# EAGLE design BinaryClock-v5 (EAGLE 7.2.0)
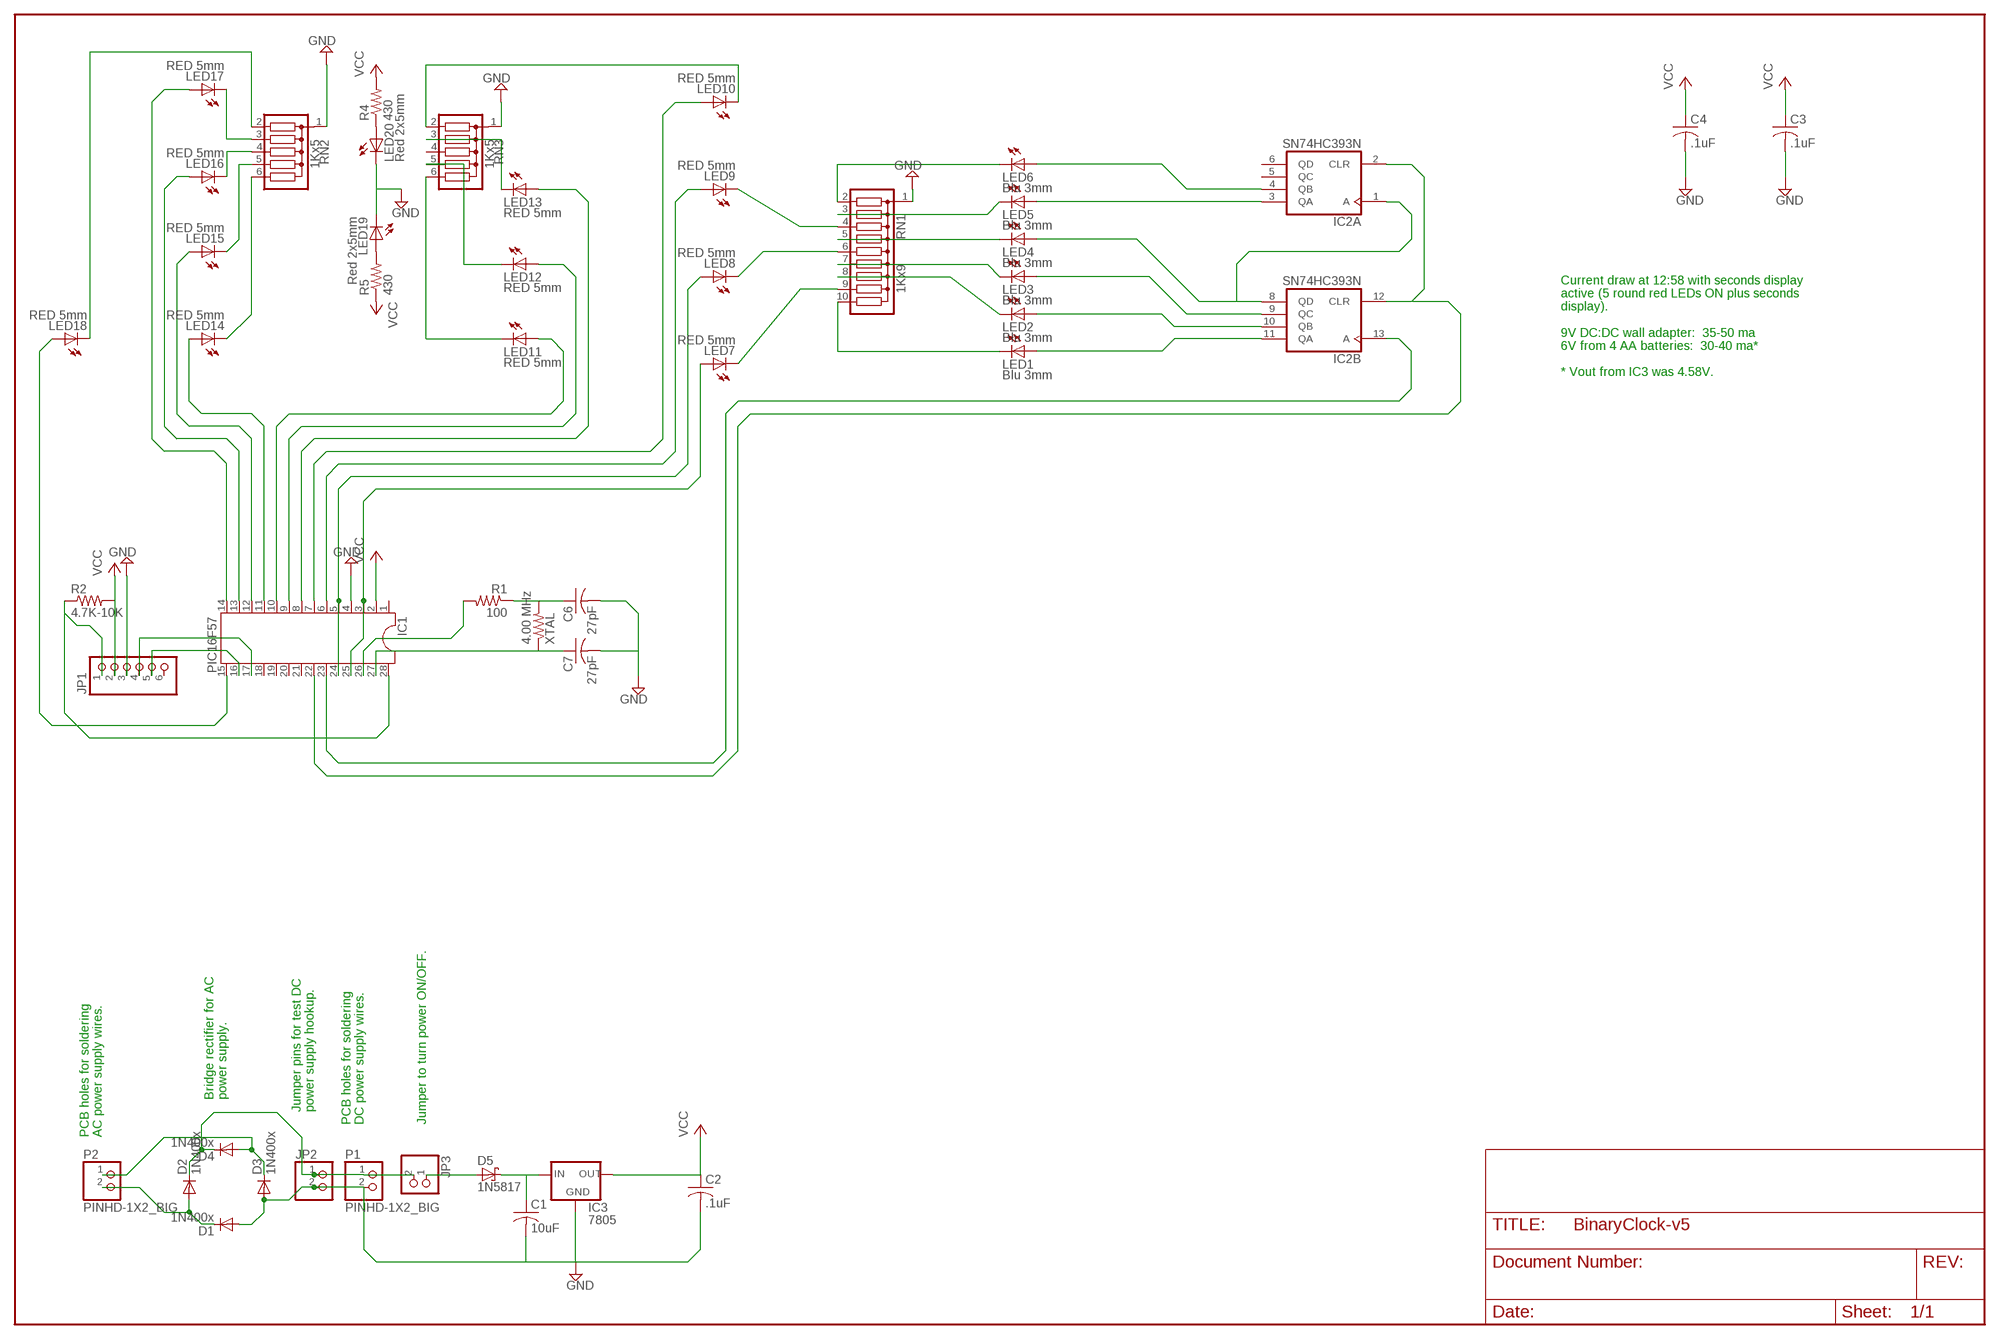
[diagram p0: schematic, sheet 1]

## Parts
C1  10uF  C-US025-050X050  [C025-050X050]
C2  .1uF  C-US050-025X075  [C050-025X075]
C3  .1uF  C-US050-025X075  [C050-025X075]
C4  .1uF  C-US050-025X075  [C050-025X075]
C6  27pF  C-US025-025X050  [C025-025X050]
C7  27pF  C-US025-025X050  [C025-025X050]
D1  1N400x  DIODE-D-7.5  [D-7.5]
D2  1N400x  DIODE-D-7.5  [D-7.5]
D3  1N400x  DIODE-D-7.5  [D-7.5]
D4  1N400x  DIODE-D-7.5  [D-7.5]
D5  1N5817  [0207/2V]
IC1  PIC16F57  DIL28-3  [DIL28-3]
IC2  SN74HC393N  74HC393N  [DIL14]
IC3  7805  78MXXS  [78MXXS]
JP1  PINHD-1X6/90  [1X06/90]
JP2  PINHD-1X2  [1X02]
JP3  PINHD-1X2  [1X02]
LED1  Blu 3mm  LED3MM  [LED3MM]
LED2  Blu 3mm  LED3MM  [LED3MM]
LED3  Blu 3mm  LED3MM  [LED3MM]
LED4  Blu 3mm  LED3MM  [LED3MM]
LED5  Blu 3mm  LED3MM  [LED3MM]
LED6  Blu 3mm  LED3MM  [LED3MM]
LED7  RED 5mm  LED5MM  [LED5MM]
LED8  RED 5mm  LED5MM  [LED5MM]
LED9  RED 5mm  LED5MM  [LED5MM]
LED10  RED 5mm  LED5MM  [LED5MM]
LED11  RED 5mm  LED5MM  [LED5MM]
LED12  RED 5mm  LED5MM  [LED5MM]
LED13  RED 5mm  LED5MM  [LED5MM]
LED14  RED 5mm  LED5MM  [LED5MM]
LED15  RED 5mm  LED5MM  [LED5MM]
LED16  RED 5mm  LED5MM  [LED5MM]
LED17  RED 5mm  LED5MM  [LED5MM]
LED18  RED 5mm  LED5MM  [LED5MM]
LED19  Red 2x5mm  U57X32  [U57X32]
LED20  Red 2x5mm  U57X32  [U57X32]
P1  PINHD-1X2_BIG  [1X02_BIG]
P2  PINHD-1X2_BIG  [1X02_BIG]
R1  100  R-US_0207/7  [0207/7]
R2  4.7K-10K  R-US_0207/2V  [0207/2V]
R4  430  R-US_0204/5  [0204/5]
R5  430  R-US_0204/7  [0204/7]
RN1  1Kx9  G09R  [SIL10]
RN2  1Kx5  G05R  [SIL6]
RN3  1Kx5  G05R  [SIL6]
XTAL  4.00 MHz  R-US_0204/5  [0204/5]

## Nets
GND: C1.2 C2.2 C3.2 C4.2 C6.2 C7.2 D1.A D3.A IC1.4 IC3.GND JP1.3 JP2.2 LED19.K(C) LED20.K(C) P1.2 RN1.1 RN2.1 RN3.1
N$1: IC2.3(A:QA) LED5.A
N$2: IC2.11(B:QA) LED1.A
N$3: IC2.10(B:QB) LED2.A
N$4: IC2.9(B:QC) LED3.A
N$5: IC2.1(A:A) IC2.8(B:QD) LED4.A
N$6: C1.1 D5.2(C) IC3.IN
N$7: IC2.4(A:QB) LED6.A
N$8: IC1.22 IC2.2(A:CLR) IC2.12(B:CLR)
N$9: C7.1 IC1.27 XTAL.1
N$10: C6.1 R1.1 XTAL.2
N$11: LED1.K(C) RN1.10
N$12: IC1.26 R1.2
N$13: LED7.K(C) RN1.9
N$14: IC1.28 JP1.1 R2.1
N$15: IC1.8 LED13.A
N$16: IC1.16 JP1.5
N$17: IC1.23 IC2.13(B:A)
N$18: IC1.3 IC1.25 LED7.A
N$19: IC1.5 IC1.24 LED8.A
N$20: IC1.6 LED9.A
N$21: IC1.7 LED10.A
N$22: IC1.9 LED12.A
N$23: IC1.10 LED11.A
N$24: IC1.11 LED14.A
N$25: IC1.12 LED15.A
N$26: IC1.13 LED16.A
N$27: IC1.14 LED17.A
N$28: IC1.17 JP1.4
N$29: LED2.K(C) RN1.8
N$30: LED4.K(C) RN1.5
N$31: IC1.15 LED18.A
N$32: LED9.K(C) RN1.4
N$33: LED3.K(C) RN1.7
N$34: LED8.K(C) RN1.6
N$35: LED5.K(C) RN1.3
N$36: LED6.K(C) RN1.2
N$37: LED10.K(C) RN3.2
N$38: LED13.K(C) RN3.3
N$39: LED11.K(C) RN3.6
N$40: LED12.K(C) RN3.5
N$41: LED14.K(C) RN2.6
N$42: LED15.K(C) RN2.5
N$43: LED16.K(C) RN2.4
N$44: LED17.K(C) RN2.3
N$45: LED18.K(C) RN2.2
N$46: D2.C D4.C JP2.1 JP3.2 P1.1
N$47: LED20.A R4.1
N$48: LED19.A R5.2
N$50: D1.C D2.A P2.2
N$51: D3.C D4.A P2.1
N$168: D5.1(A) JP3.1
VCC: C2.1 C3.1 C4.1 IC1.2 IC3.OUT JP1.2 R2.2 R4.2 R5.1
Unconnected: IC1.1 IC1.18 IC1.19 IC1.20 IC1.21 IC2.5(A:QC) IC2.6(A:QD) JP1.6 RN3.4

## Notes on the sheet
- Current draw at 12:58 with seconds display
  active (5 round red LEDs ON plus seconds
  display).
  
  9V DC:DC wall adapter:  35-50 ma
  6V from 4 AA batteries:  30-40 ma*
  
  * Vout from IC3 was 4.58V.
- Bridge rectifier for AC 
  power supply.
- Jumper pins for test DC
  power supply hookup.
- PCB holes for soldering
  DC power supply wires.
- Jumper to turn power ON/OFF.
- PCB holes for soldering
  AC power supply wires.

## Power pins joined to a net without a drawn wire
GND: IC2.7(P:GND)
VCC: IC2.14(P:VCC)

## Library data of the parts
C1-C4 C6 C7 = rcl:C-US: CAPACITOR, American symbol
D1-D4 = diode:DIODE-: DIODE
D5 = DScott:1N5817
IC1 = ic-package:DIL28: Dual In Line
IC2 = 74xx-eu:74*393: Dual 4-bit decade and binary COUNTER
IC3 = v-reg:78MXXS: VOLTAGE REGULATOR
JP1 = pinhead:PINHD-1X6: PIN HEADER
JP2 JP3 = pinhead:PINHD-1X2: PIN HEADER
LED1-LED18 = led:LED: LED OSRAM: - CHIPLED LG R971, LG N971, LY N971, LG Q971, LY Q971, LO R971, LY R971 LH N974, LH R974 LS Q976, LO Q976, LY Q976 LO Q996 - Hyper CHIPLED LW Q18S LB Q993, LB Q99A, LB R99A - SideLED LS A670, LO A670, LY A670, LG A670, LP A670 LB A673, LV A673, LT A673, LW A673 LH A674 LY A675 LS A676, LA A676, LO A676, LY A676, LW A676 LS A679, LY A679, LG A679 - Hyper Micro SIDELED® LS Y876, LA Y876, LO Y876, LY Y876 LT Y87S - SmartLED LW L88C, LW L88S LB L89C, LB L89S, LG L890 LS L89K, LO L89K, LY L89K LS L896, LA L896, LO L896, LY L896 - TOPLED LS T670, LO T670, LY T670, LG T670, LP T670 LSG T670, LSP T670, LSY T670, LOP T670, LYG T670 LG T671, LOG T671, LSG T671 LB T673, LV T673, LT T673, LW T673 LH T674 LS T676, LA T676, LO T676, LY T676, LB T676, LH T676, LSB T676, LW T676 LB T67C, LV T67C, LT T67C, LS T67K, LO T67K, LY T67K, LW E67C LS E67B, LA E67B, LO E67B, LY E67B, LB E67C, LV E67C, LT E67C LW T67C LS T679, LY T679, LG T679 LS T770, LO T770, LY T770, LG T770, LP T770 LB T773, LV T773, LT T773, LW T773 LH T774 LS E675, LA E675, LY E675, LS T675 LS T776, LA T776, LO T776, LY T776, LB T776 LHGB T686 LT T68C, LB T68C - Hyper Mini TOPLED® LB M676 - Mini TOPLED Santana® LG M470 LS M47K, LO M47K, LY M47K Source: http://www.osram.convergy.de LUXEON: - LUMILED® LXK2-PW12-R00, LXK2-PW12-S00, LXK2-PW14-U00, LXK2-PW14-V00 LXK2-PM12-R00, LXK2-PM12-S00, LXK2-PM14-U00 LXK2-PE12-Q00, LXK2-PE12-R00, LXK2-PE12-S00, LXK2-PE14-T00, LXK2-PE14-U00 LXK2-PB12-K00, LXK2-PB12-L00, LXK2-PB12-M00, LXK2-PB14-N00, LXK2-PB14-P00, LXK2-PB14-Q00 LXK2-PR12-L00, LXK2-PR12-M00, LXK2-PR14-Q00, LXK2-PR14-R00 LXK2-PD12-Q00, LXK2-PD12-R00, LXK2-PD12-S00 LXK2-PH12-R00, LXK2-PH12-S00 LXK2-PL12-P00, LXK2-PL12-Q00, LXK2-PL12-R00 Source: www.luxeon.com KINGBRIGHT: KA-3528ASYC Source: www.kingbright.com
LED19 LED20 = led:U57X32: LED rectangle, 5.7 x 3.2 mm
P1 P2 = DScott:PINHD-1X2_BIG
R1 R2 R4 R5 XTAL = rcl:R-US_: RESISTOR, American symbol
RN1 = resistor-sil:G09R: SIL RESISTOR; OC_FARNELL: unknown; OC_NEWARK: unknown
RN2 RN3 = resistor-sil:G05R: SIL RESISTOR; OC_FARNELL: unknown; OC_NEWARK: unknown

## Net classes
0 default: width 0.305 mm, clearance 0.305 mm

## Board
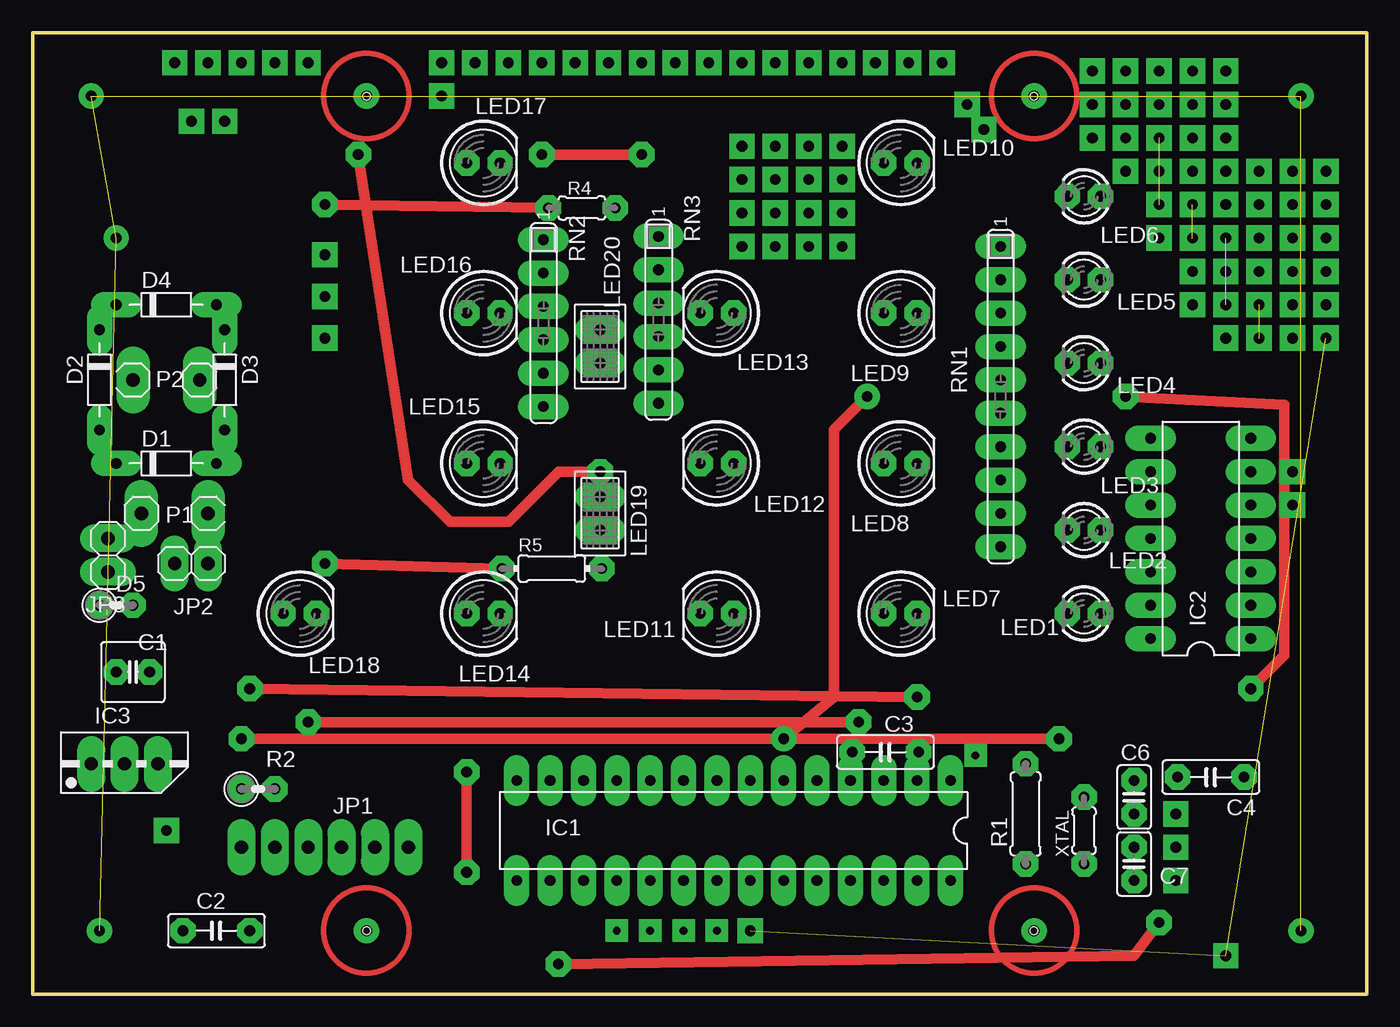
[diagram p1: board, top side]
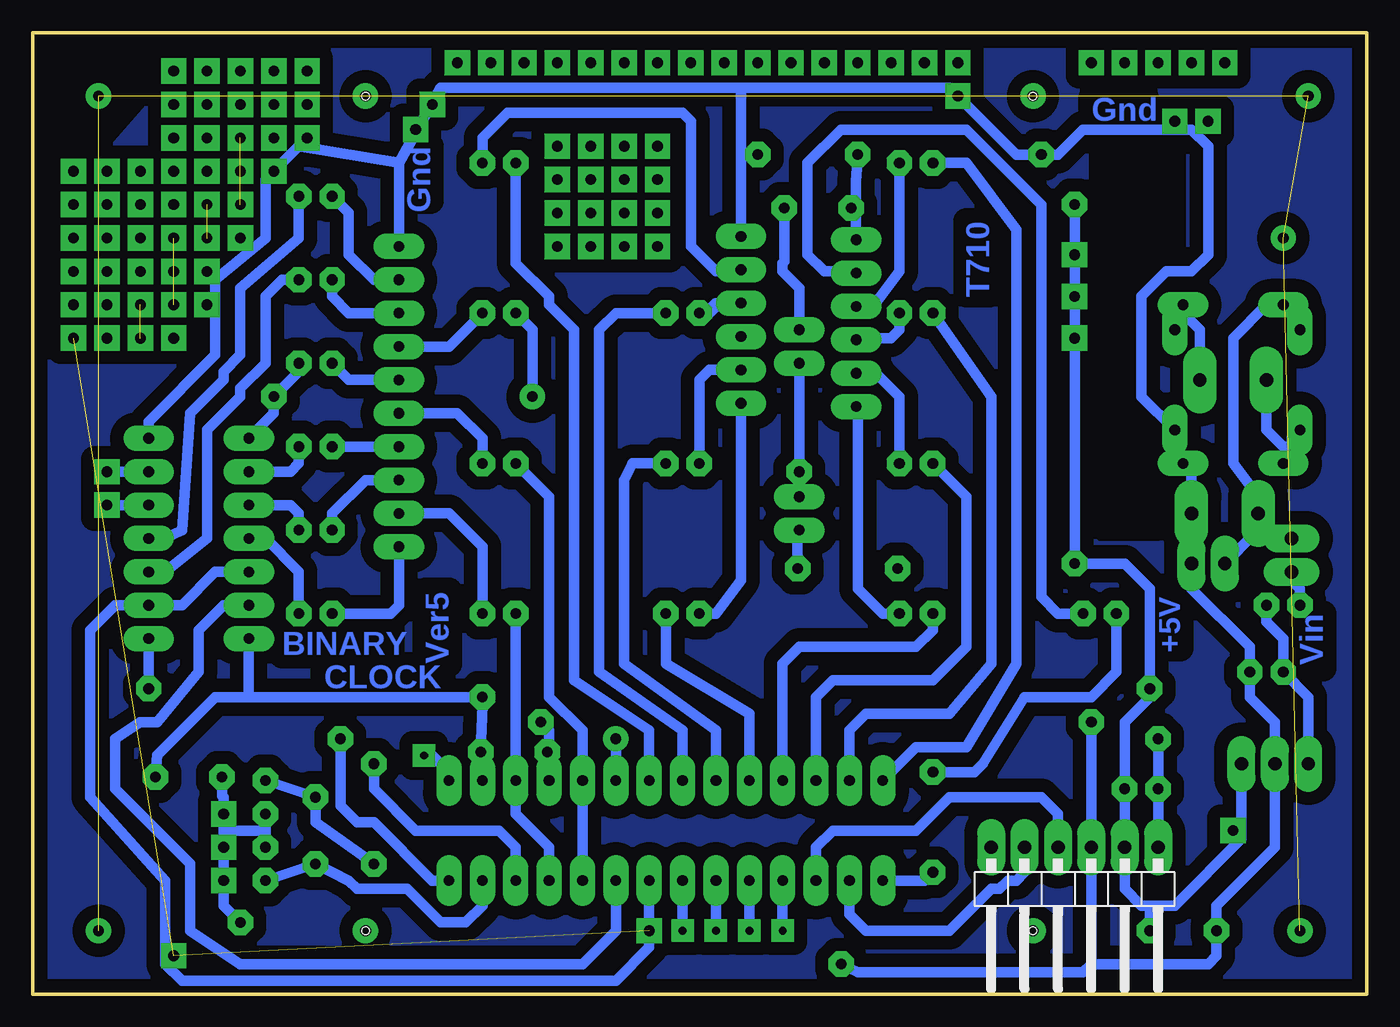
[diagram p2: board, bottom side, seen from below]

Size 101.52 x 73.14 mm. Coordinates in mm from the lower left corner, seen from the top.
Outline: 0,0 101.52,0 101.52,73.14 0,73.14 0,0
Copper layers (1*16): Top 0.035mm / dielectric 1.5mm / Bottom 0.035mm
Design rules "default *": minimum track width 32mil, minimum drill 32mil, track to track 8mil, track to pad 8mil, pad to pad 8mil, via to via 8mil, smd to smd 8mil, copper to edge 8mil, drill to drill 8mil, minimum pad ring 22mil, minimum via ring 22mil, stop-mask expansion 4mil, vias tented up to drill 0mil, thermal gap 10mil
Holes 0.6 mm at 25.4,68.33 76.2,68.33 76.2,4.83 25.4,4.83

### Footprints (pad centres in the part's own frame; a part is rotated, then mirrored left to right if it is on the bottom)
C025-050X050 = drill 0.813 octagon: 1 -1.27,0; 2 1.27,0
C050-025X075 = drill 0.813 octagon: 1 -2.54,0; 2 2.54,0
C025-025X050 = drill 0.813 octagon: 1 -1.27,0; 2 1.27,0
D-7.5 = drill 0.813 long: A 3.81,0; C -3.81,0
0207/2V = drill 0.813 octagon: 1 -1.27,0; 2 1.27,0
DIL28-3 = drill 0.813 long: 1 -16.51,-3.81; 2 -13.97,-3.81; 3 -11.43,-3.81; 4 -8.89,-3.81; 5 -6.35,-3.81; 6 -3.81,-3.81; 7 -1.27,-3.81; 8 1.27,-3.81; 9 3.81,-3.81; 10 6.35,-3.81; 11 8.89,-3.81; 12 11.43,-3.81; 13 13.97,-3.81; 14 16.51,-3.81; 15 16.51,3.81; 16 13.97,3.81; 17 11.43,3.81; 18 8.89,3.81; 19 6.35,3.81; 20 3.81,3.81; 21 1.27,3.81; 22 -1.27,3.81; 23 -3.81,3.81; 24 -6.35,3.81; 25 -8.89,3.81; 26 -11.43,3.81; 27 -13.97,3.81; 28 -16.51,3.81
DIL14 = drill 0.813 long: 1 -7.62,-3.81; 2 -5.08,-3.81; 3 -2.54,-3.81; 4 0,-3.81; 5 2.54,-3.81; 6 5.08,-3.81; 7 7.62,-3.81; 8 7.62,3.81; 9 5.08,3.81; 10 2.54,3.81; 11 0,3.81; 12 -2.54,3.81; 13 -5.08,3.81; 14 -7.62,3.81
78MXXS = drill 1.016 long: GND 0,-2.54; IN -2.54,-2.54; OUT 2.54,-2.54
1X06/90 = drill 1.016 long: 1 -6.35,-3.81; 2 -3.81,-3.81; 3 -1.27,-3.81; 4 1.27,-3.81; 5 3.81,-3.81; 6 6.35,-3.81
1X02 = drill 1.016 long: 1 -1.27,0; 2 1.27,0
LED3MM = drill 0.813 octagon: A -1.27,0; K 1.27,0
LED5MM = drill 0.813 octagon: A -1.27,0; K 1.27,0
U57X32 = drill 0.813 long: A -1.27,0; K 1.27,0
1X02_BIG = drill 1.016 pad 2.54 long: 1 -1.27,0; 2 3.81,0
0207/7 = drill 0.813 octagon: 1 -3.81,0; 2 3.81,0
0204/5 = drill 0.813 octagon: 1 -2.54,0; 2 2.54,0
0204/7 = drill 0.813 octagon: 1 -3.81,0; 2 3.81,0
SIL10 = drill 0.813 long: 1 -11.43,0; 2 -8.89,0; 3 -6.35,0; 4 -3.81,0; 5 -1.27,0; 6 1.27,0; 7 3.81,0; 8 6.35,0; 9 8.89,0; 10 11.43,0
SIL6 = drill 0.813 long: 1 -6.35,0; 2 -3.81,0; 3 -1.27,0; 4 1.27,0; 5 3.81,0; 6 6.35,0

### Placement (x,y rotation side)
C1  7.62,24.51 0 top
C2  13.97,4.83 180 top
C3  64.9,18.41 180 top
C4  89.66,16.51 180 top
C6  83.82,14.99 270 top
C7  83.82,9.91 90 top
D1  10.16,40.39 0 top
D2  5.08,46.74 270 top
D3  14.61,46.74 270 top
D4  10.16,52.45 0 top
D5  6.35,29.59 0 top
IC1  53.34,12.45 180 top
IC2  88.9,34.67 90 top
IC3  6.99,20.07 0 top
JP1  22.23,7.37 180 bottom
JP2  12.06,32.77 0 top
JP3  5.71,33.4 90 top
LED1  80.01,28.96 180 top
LED2  80.01,35.31 180 top
LED3  80.01,41.66 180 top
LED4  80.01,48.01 180 top
LED5  80.01,54.36 180 top
LED6  80.01,60.71 180 top
LED7  66.04,28.96 0 top
LED8  66.04,40.39 0 top
LED9  66.04,51.82 0 top
LED10  66.04,63.25 0 top
LED11  52.07,28.96 180 top
LED12  52.07,40.39 180 top
LED13  52.07,51.82 180 top
LED14  34.29,28.96 0 top
LED15  34.29,40.39 0 top
LED16  34.29,51.82 0 top
LED17  34.29,63.25 0 top
LED18  20.32,28.96 0 top
LED19  43.18,36.58 90 top
LED20  43.18,49.28 270 top
P1  9.53,36.58 0 top
P2  11.43,46.74 180 top
R1  75.56,13.72 90 top
R2  17.14,15.62 0 top
R4  41.78,59.82 180 top
R5  39.5,32.39 0 top
RN1  73.66,45.47 270 top
RN2  38.86,51.05 270 top
RN3  47.62,51.31 270 top
XTAL  80.01,12.45 90 top

### Tracks (layer width: path | path; a pad name or v marks a point on that pad's centre or on a via)
GND  (via drill 0.81)
  Top 0.813: v46.35,63.88 v38.73,63.88 | v62.87,20.7 v20.95,20.7 | v85.72,5.46 83.82,2.92 v40.01,2.29 | v43.18,39.75 40.01,39.75 36.2,35.94 31.75,35.94 28.57,39.12 v24.77,63.88
  Bottom 0.813: 47.62,68.96 47.62,63.88 | 73.66,63.25 70.48,68.96 47.62,68.96 | RN3.1 47.62,63.88 | 47.62,63.88 v46.35,63.88 | v38.73,63.88 38.86,61.85 RN2.1 | RN1.1 73.66,63.25 | 73.66,63.25 81.28,64.52 83.82,61.98 83.82,57.53 87.63,54.36 87.63,48.64 92.71,43.56 IC2.7 | C4.2 87.12,15.11 87,14.99 87,12.45 | IC1.4 62.36,16.38 62.36,18.16 | 62.36,18.16 C3.2 | LED19.K v43.18,39.75 LED20.K | 62.36,18.16 62.23,18.16 62.23,20.07 v62.87,20.7 | 83.82,12.45 87,12.45 | 87,12.45 87,6.73 v85.72,5.46 | C7.2 83.82,12.45 | 83.82,12.45 C6.2 | v20.95,20.7 JP1.3 20.95,2.29 | 47.62,68.96 31.75,68.96 26.67,63.88 v24.77,63.88 23.5,63.88 21.59,65.79 13.34,65.79 12.06,64.52 12.06,56.26 13.34,54.99 15.24,54.99 17.14,53.09 17.14,45.47 D3.A 14.61,41.02 D1.A | 20.95,2.29 21.59,1.65 38.73,1.65 v40.01,2.29 | D1.A | 13.97,41.02 D1.A | D1.A 13.34,40.39 P1.2 JP2.2 13.34,30.86 8.89,26.42 C1.2 8.89,22.61 6.99,20.7 IC3.GND 6.99,11.18 11.43,6.73 C2.2 11.43,2.92 12.06,2.29 20.95,2.29
N$1
  Bottom 0.813: IC2.3 91.44,32.13 88.27,34.67 88.27,42.93 85.72,45.47 85.72,46.1 83.82,48.01 83.82,53.09 82.55,54.36 LED5.A
N$2
  Bottom 0.813: IC2.11 83.82,34.67 81.28,32.13 LED1.A
N$3
  Bottom 0.813: IC2.10 81.92,37.21 81.28,36.58 LED2.A
N$4
  Bottom 0.813: IC2.9 81.92,39.75 81.28,40.39 LED3.A
N$5  (via drill 0.81)
  Top 0.813: v92.71,23.24 95.25,25.78 95.25,44.83 v83.19,45.47
  Bottom 0.813: IC2.8 83.19,44.2 v83.19,45.47 81.28,47.37 LED4.A | IC2.1 v92.71,23.24
N$6
  Bottom 0.813: IC3.IN 4.45,22.61 C1.1 6.35,27.05 7.62,28.32 D5.2
N$7
  Bottom 0.813: IC2.4 91.44,34.67 90.17,35.31 89.53,44.2 87,46.74 87,47.37 85.72,48.64 85.72,53.72 81.28,57.53 LED6.A
N$8
  Bottom 0.813: IC2.12 87.63,32.13 90.17,29.59 IC2.2 95.25,29.59 97.16,27.69 97.16,14.99 91.44,8.64 91.44,2.29 90.17,1.02 57.15,1.02 54.61,3.56 IC1.22
N$9
  Bottom 0.813: C7.1 XTAL.1 77.47,8.64 76.83,8 73.03,8 70.48,5.46 68.58,5.46 67.31,6.73 IC1.27
N$10
  Bottom 0.813: C6.1 XTAL.2 80.01,13.08 R1.1
N$11
  Bottom 0.813: RN1.10 73.66,29.59 74.3,28.96 LED1.K
N$12
  Bottom 0.813: IC1.26 64.77,11.18 66.04,12.45 72.39,12.45 75.56,15.62 R1.2
N$13
  Bottom 0.813: RN1.9 69.85,36.58 67.31,34.04 LED7.K
N$14  (via drill 0.81)
  Top 0.813: v78.11,19.43 v15.88,19.43
  Bottom 0.813: JP1.1 R2.1 v15.88,19.43 | IC1.28 71.12,8.64 75.56,13.08 76.83,13.08 78.11,14.35 v78.11,19.43
N$15
  Bottom 0.813: IC1.8 52.07,20.07 58.42,24.51 58.42,50.55 57.15,51.82 LED13.A
N$16
  Bottom 0.813: IC1.16 39.37,6.1 38.1,4.83 31.75,4.83 28.57,8 27.94,8 27.3,8.64 26.67,8.64 26.04,9.27 JP1.5
N$17
  Bottom 0.813: IC1.23 57.15,4.83 59.69,2.29 85.72,2.29 89.53,4.83 89.53,9.91 95.25,15.62 95.25,19.43 93.34,20.7 92.08,20.7 88.9,24.51 88.9,27.69 87,29.59 IC2.13
N$18
  Bottom 0.813: LED7.A IC1.3 64.77,13.72 62.23,11.18 IC1.25
N$19
  Bottom 0.813: LED8.A 62.23,37.85 62.23,22.61 59.69,20.07 IC1.5 IC1.24
N$20  (via drill 0.81)
  Top 0.813: v57.15,19.43 60.96,22.61 60.96,42.93 v63.5,45.47
  Bottom 0.813: IC1.6 v57.15,19.43 | v63.5,45.47 63.5,50.55 LED9.A
N$21
  Bottom 0.813: IC1.7 54.61,20.07 60.33,23.88 60.33,50.55 62.23,52.45 62.23,53.09 64.77,55.63 LED10.A
N$22
  Bottom 0.813: IC1.9 49.53,20.07 56.52,25.15 56.52,39.12 55.88,40.39 LED12.A
N$23
  Bottom 0.813: IC1.10 46.99,21.34 53.34,25.15 LED11.A
N$24
  Bottom 0.813: IC1.11 44.45,25.15 43.18,26.42 34.29,26.42 33.02,27.69 LED14.A
N$25
  Bottom 0.813: IC1.12 41.91,22.61 40.64,23.88 33.02,23.88 30.48,26.42 30.48,37.85 LED15.A
N$26
  Bottom 0.813: IC1.13 39.37,20.07 38.1,21.34 31.75,21.34 28.57,25.15 28.57,45.47 LED16.A
N$27
  Bottom 0.813: IC1.14 34.29,18.8 30.48,18.8 26.67,25.15 26.67,58.17 30.48,63.25 LED17.A
N$28
  Bottom 0.813: IC1.17 41.91,11.18 40.64,12.45 34.29,12.45 31.75,14.99 24.77,14.99 23.5,13.72 JP1.4
N$29
  Bottom 0.813: RN1.8 76.2,39.12 78.74,36.58 LED2.K
N$30
  Bottom 0.813: RN1.5 77.47,46.74 LED4.K
N$31  (via drill 0.81)
  Top 0.813: v33.02,16.89 v33.02,9.27
  Bottom 0.813: LED18.A 19.05,24.51 20.95,22.61 26.04,22.61 29.21,17.53 29.84,16.89 v33.02,16.89 | v33.02,9.27 33.66,8.64 IC1.15
N$32
  Bottom 0.813: RN1.4 69.85,49.28 LED9.K
N$33
  Bottom 0.813: RN1.7 LED3.K
N$34
  Bottom 0.813: RN1.6 69.22,44.2 67.31,42.29 LED8.K
N$35
  Bottom 0.813: RN1.3 77.47,51.82 78.74,53.09 LED5.K
N$36
  Bottom 0.813: RN1.2 75.56,54.36 77.47,56.26 77.47,59.44 LED6.K
N$37
  Bottom 0.813: LED10.K 67.31,65.15 65.41,67.06 52.07,67.06 51.44,66.42 51.44,56.9 49.53,54.99 47.12,54.99 47.24,55.12 RN3.2
N$38
  Bottom 0.813: 49.53,52.45 47.12,52.45 47.24,52.58 RN3.3 | 50.16,51.82 LED13.K
  Bottom 1.016: 49.53,52.45 50.16,51.82
N$39
  Bottom 0.813: LED11.K 49.53,28.96 47.62,31.5 RN3.6
N$40
  Bottom 0.813: LED12.K 50.8,46.74 50.04,47.5 RN3.5
N$41
  Bottom 0.813: RN2.6 38.73,44.58 38.73,30.86 36.83,28.96 LED14.K
N$42
  Bottom 0.813: LED15.K 35.56,45.47 37.47,47.37 37.59,47.24 RN2.5
N$43
  Bottom 0.813: LED16.K 35.56,50.55 36.2,49.91 39.37,49.91 39.24,49.78 RN2.4
N$44
  Bottom 0.813: LED17.K 35.56,54.99 37.47,52.45 39.37,52.45 39.24,52.32 RN2.3
N$45
  Bottom 0.813: 39.62,54.99 RN2.2 38.99,54.99 39.62,54.99 | 39.62,54.99 41.27,54.99 42.55,56.26 42.55,63.25 40.01,65.79 30.48,65.79 24.77,60.07 24.77,30.23 23.5,28.96 LED18.K
N$46
  Bottom 0.813: D2.C 5.08,51.82 5.71,52.45 D4.C 7.62,52.45 10.16,49.91 10.16,40.39 8.26,37.85 P1.1 8.26,35.31 8.57,34.99 | JP2.1 8.57,34.99 | JP3.2 6.03,34.99 8.57,34.99
N$47
  Bottom 0.813: LED20.A 43.18,53.72 44.45,54.99 44.45,55.63 44.32,55.75 R4.1
N$48
  Bottom 0.813: LED19.A 43.31,35.18 R5.2
N$50
  Bottom 0.813: D2.A 5.71,42.29 5.71,41.02 D1.C 6.35,41.02 5.71,41.66 6.35,41.66 7.62,42.93 P2.2
N$51
  Bottom 0.813: 13.97,51.82 12.7,50.55 P2.1 | 13.97,51.82 D4.A | 13.97,51.82 14.61,51.18 D3.C
N$52
  cutout Bottom: 13.97,64.52 13.97,56.26 18.41,54.36 18.41,44.83 16.51,42.93 16.51,39.12 15.24,39.12 15.24,35.31 15.88,34.67 20.32,34.67 20.95,35.31 20.95,63.88 20.32,64.52
N$53  (via drill 0.81)
  other vias: 22.23,56.26
N$54  (via drill 0.81)
  other vias: 22.23,53.09
N$55  (via drill 0.81)
  other vias: 10.16,12.45
N$56  (via drill 0.81)
  other vias: 71.12,67.69
N$57  (via drill 0.81)
  other vias: 80.64,65.15
N$58  (via drill 0.81)
  other vias: 72.39,65.79
N$59  (via drill 0.81)
  other vias: 87,8.64
N$63  (via drill 0.81)
  other vias: 87,11.18
N$64  (via drill 0.81)
  other vias: 87,13.72
N$65  (via drill 0.81)
  other vias: 22.23,49.91
N$66  (via drill 0.81)
  other vias: 31.11,68.33
N$67  (via drill 0.81)
  other vias: 14.61,66.42
N$68  (via drill 0.81)
  other vias: 88.27,54.99
N$69  (via drill 0.81)
  other vias: 88.27,52.45
N$70  (via drill 0.81)
  other vias: 85.72,57.53
N$71  (via drill 0.81)
  other vias: 90.81,49.91
N$76  (via drill 0.81)
  other vias: 18.41,70.87
N$77  (via drill 0.81)  (5 unrouted)
  other vias: 25.4,68.33 4.45,68.33 5.08,4.83 96.52,4.83 96.52,68.33 6.35,57.53
N$78  (via drill 0.81)
  other vias: 83.19,65.15
N$79  (via drill 0.81)
  other vias: 83.19,62.61
N$80  (via drill 0.81)
  other vias: 25.4,4.83
N$81  (via drill 0.81)
  other vias: 53.98,64.52
N$82  (via drill 0.81)
  other vias: 56.52,64.52
N$83  (via drill 0.81)
  other vias: 59.05,64.52
N$84  (via drill 0.81)
  other vias: 61.59,64.52
N$85  (via drill 0.81)
  other vias: 61.59,61.98
N$86  (via drill 0.81)
  other vias: 59.05,61.98
N$87  (via drill 0.81)
  other vias: 56.52,61.98
N$88  (via drill 0.81)
  other vias: 53.98,61.98
N$89  (via drill 0.81)
  other vias: 53.98,59.44
N$90  (via drill 0.81)
  other vias: 56.52,59.44
N$91  (via drill 0.81)
  other vias: 59.05,59.44
N$92  (via drill 0.81)
  other vias: 61.59,59.44
N$93  (via drill 0.81)
  other vias: 61.59,56.9
N$94  (via drill 0.81)
  other vias: 59.05,56.9
N$95  (via drill 0.81)
  other vias: 56.52,56.9
N$96  (via drill 0.81)
  other vias: 53.98,56.9
N$97  (via drill 0.81)
  other vias: 76.2,4.83
N$98  (via drill 0.81)
  other vias: 76.2,68.33
N$99  (via drill 0.6)
  Bottom 0.813: v44.45,4.83 44.45,7.37
N$100  (via drill 0.81)
  other vias: 80.64,67.69
N$101  (via drill 0.81)
  other vias: 83.19,67.69
N$102  (via drill 0.81)
  other vias: 85.72,67.69
N$103  (via drill 0.81)
  other vias: 88.27,67.69
N$104  (via drill 0.81)
  other vias: 90.81,67.69
N$105  (via drill 0.81)
  other vias: 90.81,70.23
N$106  (via drill 0.81)
  other vias: 88.27,70.23
N$107  (via drill 0.81)
  other vias: 85.72,70.23
N$108  (via drill 0.81)
  other vias: 83.19,70.23
N$109  (via drill 0.81)
  other vias: 80.64,70.23
N$110  (via drill 0.6)
  Bottom 0.813: v46.99,4.83 46.99,7.37
N$111  (via drill 0.81)  (2 unrouted)
  other vias: 85.72,65.15 85.72,62.61 85.72,60.07
N$112  (via drill 0.81)
  other vias: 88.27,65.15
N$113  (via drill 0.81)
  other vias: 90.81,65.15
N$114  (via drill 0.81)
  other vias: 88.27,62.61
N$115  (via drill 0.81)
  other vias: 90.81,62.61
N$116  (via drill 0.81)
  other vias: 93.34,62.61
N$117  (via drill 0.81)
  other vias: 95.89,62.61
N$118  (via drill 0.81)
  other vias: 98.42,62.61
N$119  (via drill 0.81)
  other vias: 98.42,60.07
N$120  (via drill 0.81)
  other vias: 95.89,60.07
N$121  (via drill 0.81)
  other vias: 93.34,60.07
N$122  (via drill 0.81)
  other vias: 90.81,60.07
N$123  (via drill 0.81)
  other vias: 93.34,57.53
N$124  (via drill 0.81)
  other vias: 95.89,57.53
N$125  (via drill 0.81)
  other vias: 98.42,57.53
N$126  (via drill 0.81)
  other vias: 98.42,54.99
N$127  (via drill 0.81)
  other vias: 95.89,49.91
N$128  (via drill 0.81)
  other vias: 95.89,52.45
N$129  (via drill 0.81)
  other vias: 98.42,52.45
N$130  (via drill 0.6)
  Bottom 0.813: v49.53,4.83 49.53,7.37
N$131  (via drill 0.81)
  other vias: 69.22,70.87
N$132  (via drill 0.81)
  other vias: 66.67,70.87
N$133  (via drill 0.81)
  other vias: 64.14,70.87
N$134  (via drill 0.81)
  other vias: 61.59,70.87
N$135  (via drill 0.81)
  other vias: 59.05,70.87
N$136  (via drill 0.81)
  other vias: 56.52,70.87
N$137  (via drill 0.81)
  other vias: 53.98,70.87
N$138  (via drill 0.81)
  other vias: 51.44,70.87
N$139  (via drill 0.81)
  other vias: 48.9,70.87
N$140  (via drill 0.81)
  other vias: 46.35,70.87
N$141  (via drill 0.81)
  other vias: 43.81,70.87
N$142  (via drill 0.81)
  other vias: 41.27,70.87
N$143  (via drill 0.81)
  other vias: 38.73,70.87
N$144  (via drill 0.81)
  other vias: 36.2,70.87
N$145  (via drill 0.81)
  other vias: 33.66,70.87
N$146  (via drill 0.81)
  other vias: 31.11,70.87
N$147  (via drill 0.6)
  other vias: 52.07,4.83
N$148  (via drill 0.6)
  Bottom 0.813: v71.75,18.16 71.12,18.16 70.48,17.53
N$149  (via drill 0.81)  (1 unrouted)
  other vias: 88.27,60.07 88.27,57.53
N$150  (via drill 0.81)
  other vias: 20.95,70.87
N$151  (via drill 0.81)
  other vias: 13.34,70.87
N$152  (via drill 0.81)  (2 unrouted)
  other vias: 90.81,57.53 90.81,54.99 90.81,52.45
N$153
  pour Bottom (isolate 1.016): 0,72.77 0,0.38 101.6,0.38 101.6,57.53 88.27,72.77
N$154  (via drill 0.81)  (1 unrouted)
  other vias: 93.34,52.45 93.34,49.91
N$155  (via drill 0.81)
  other vias: 93.34,54.99
N$156  (via drill 0.81)
  other vias: 95.89,54.99
N$159  (via drill 0.81)  (2 unrouted)
  other vias: 98.42,49.91 90.81,2.92 54.61,4.83
N$160
  Bottom 0.813: 52.07,5.46 52.07,7.37
N$161  (via drill 0.81)
  other vias: 15.88,70.87
N$162  (via drill 0.81)
  other vias: 10.79,70.87
N$163  (via drill 0.81)
  other vias: 95.89,39.75
N$164  (via drill 0.81)
  other vias: 95.89,37.21
N$165
  Bottom 0.813: 93.34,39.75 95.25,39.75
N$166
  Bottom 0.813: 93.34,37.21 95.25,37.21
N$167  (via drill 0.81)
  other vias: 12.06,66.42
N$168
  Bottom 0.813: D5.1 5.08,30.86 5.71,31.5 JP3.1
VCC  (via drill 0.81)
  Top 0.813: v67.31,22.61 v16.51,23.24 | R5.1 v22.23,32.77 | R4.2 v22.23,60.07
  Bottom 0.813: IC1.2 67.44,16.38 C3.1 67.31,21.97 v67.31,22.61 85.09,22.61 | IC3.OUT 9.53,11.81 14.61,6.73 16.51,6.73 | 16.51,6.73 C2.1 | 16.51,6.73 17.14,6.73 18.41,8 JP1.2 R2.2 18.41,20.7 16.51,22.61 v16.51,23.24 16.51,30.86 18.41,32.77 v22.23,32.77 v22.23,60.07 | 85.09,22.61 IC2.14 | C4.1 92.08,18.16 87.63,22.61 85.09,22.61
(copper drawn outside any net)
  shapes: Top circle x5

### Text on the board
Bottom: Gnd | Gnd | T710 | +5V | Vin | BINARY | Ver5 | CLOCK